# Altium schematic sheet Peripherals.SchDoc
size A4
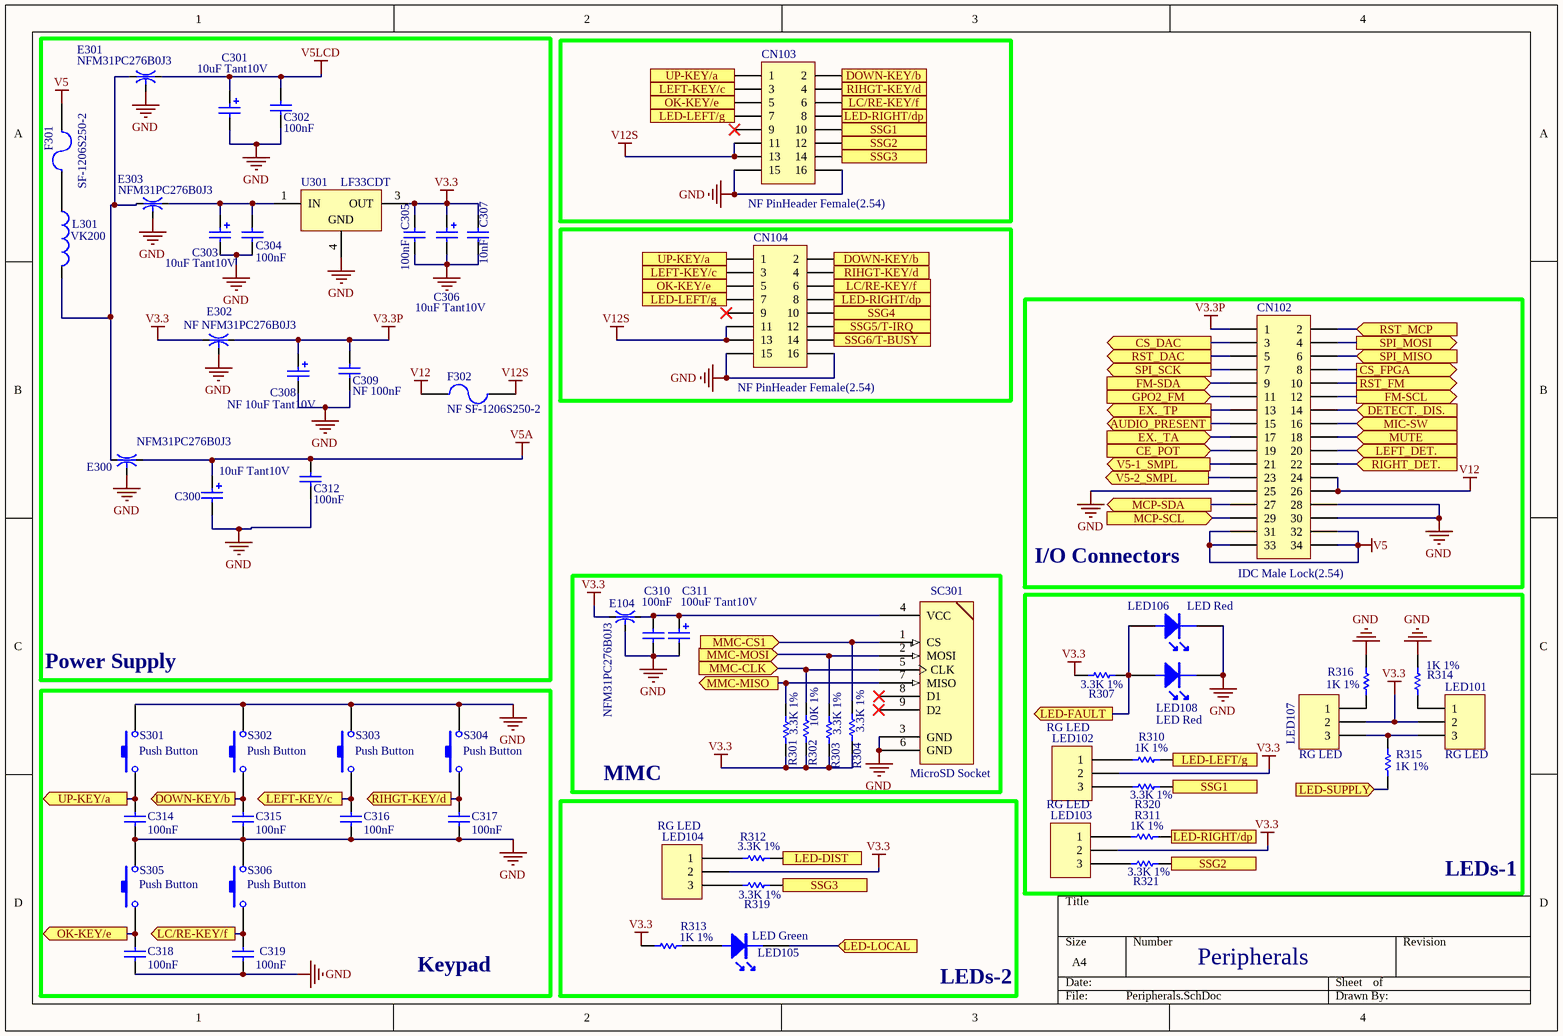
[diagram p0: Peripherals.SchDoc]

## Parts
C300  10uF Tant10V  [A]
C301  10uF Tant10V  [A]
C302  100nF  [1206_FA]
C303  10uF Tant10V  [A]
C304  100nF  [1206_FA]
C305  100nF  [1206_FA]
C306  10uF Tant10V  [A]
C307  10nF  [1206_FA]
C308  NF 10uF Tant10V  [A]
C309  NF 100nF  [1206_FA]
C310  100nF  [1206_FA]
C311  100uF Tant10V  [C]
C312  100nF  [1206_FA]
C314  100nF  [1206_FA]
C315  100nF  [1206_FA]
C316  100nF  [1206_FA]
C317  100nF  [1206_FA]
C318  100nF  [1206_FA]
C319  100nF  [1206_FA]
CN102  IDC Male Lock(2.54)  [IDC_LOCK 2X17]
CN103  NF PinHeader Female(2.54)  [HDR2*8_M]
CN104  NF PinHeader Female(2.54)  [HDR2*8_M]
E104  NFM31PC276B0J3  [EMI1206]
E300  NFM31PC276B0J3  [EMI-1206]
E301  NFM31PC276B0J3  [EMI1206]
E302  NF NFM31PC276B0J3  [EMI1206]
E303  NFM31PC276B0J3  [EMI1206]
F301  SF-1206S250-2  [1206_FA]
F302  NF SF-1206S250-2  [1206_FA]
L301  VK200  [VK200]
LED101  RG LED  [LED3CA]
LED102  RG LED  [LED3CA]
LED103  RG LED  [LED3CA]
LED104  RG LED  [LED3CA]
LED105  LED Green  [LED RADIALl 0.1]
LED106  LED Red  [LED RADIALl 0.1]
LED107  RG LED  [LED3CA]
LED108  LED Red  [LED RADIALl 0.1]
R301  3.3K 1%  [1206_FA]
R302  10K 1%  [1206_FA]
R303  3.3K 1%  [1206_FA]
R304  3.3K 1%  [1206_FA]
R307  3.3K 1%  [1206_FA]
R310  1K 1%  [1206_FA]
R311  1K 1%  [1206_FA]
R312  3.3K 1%  [1206_FA]
R313  1K 1%  [1206_FA]
R314  1K 1%  [1206_FA]
R315  1K 1%  [1206_FA]
R316  1K 1%  [1206_FA]
R319  3.3K 1%  [1206_FA]
R320  3.3K 1%  [1206_FA]
R321  3.3K 1%  [1206_FA]
S301  value Push Button  [Push Bottom  12*12*22]  (hidden comment: Push Button 12x12x22)
S302  value Push Button  [Push Bottom  12*12*22]  (hidden comment: Push Button 12x12x22)
S303  value Push Button  [Push Bottom  12*12*22]  (hidden comment: Push Button 12x12x22)
S304  value Push Button  [Push Bottom  12*12*22]  (hidden comment: Push Button 12x12x22)
S305  value Push Button  [Push Bottom  12*12*22]  (hidden comment: Push Button 12x12x22)
S306  value Push Button  [Push Bottom  12*12*22]  (hidden comment: Push Button 12x12x22)
SC301  MicroSD Socket  [Micro SD Sock.]
U301  LF33CDT  [TO-252]

## Blocks framed on the sheet
Power Supply: C300-C309 C312 E300-E303 F301 F302 L301 U301
I/O Connectors: CN102
MMC: C310 C311 E104 R301-R304 SC301
LEDs-1: LED101-LED103 LED106-LED108 R307 R310 R311 R314-R316 R320 R321

## Ports
AUDIO_PRESENT (out), CE_POT (in), CS_DAC (out), CS_FPGA (out), DETECT._DIS. (in), DOWN-KEY/b (out), EX._TA (in), EX._TP (out), FM-SCL (out), FM-SDA (in), GPO2_FM (in), LC/RE-KEY/f (out), LED-DIST (in), LED-FAULT (out), LED-LEFT/g (out), LED-LOCAL (in), LED-RIGHT/dp (out), LED-SUPPLY (in), LEFT-KEY/c (out), LEFT_DET. (in), MCP-SCL (in), MCP-SDA (out), MIC-SW (in), MMC-CLK (in), MMC-CS1 (in), MMC-MISO (out), MMC-MOSI (in), MUTE (in), OK-KEY/e (out), RIGHT_DET. (in), RIHGT-KEY/d (out), RST_DAC (out), RST_FM (out), RST_MCP (in), SPI_MISO (in), SPI_MOSI (out), SPI_SCK (out), SSG1 (out), SSG2 (out), SSG3 (out), SSG4 (out), SSG5/T-IRQ (out), SSG6/T-BUSY (out), UP-KEY/a (out), V5-1_SMPL (out), V5-2_SMPL (out)

## Nets
GND: C300.2 C301.2 C302.1 C303.2 C304.1 C305.1 C306.2 C307.1 C308.2 C309.1 C310.2 C311.2 C312.1 C314.1 C315.1 C316.1 C317.1 C318.1 C319.1 CN102.25 CN102.28 CN102.30 CN103.15 CN103.16 CN104.15 CN104.16 E104.2 E300.2 E301.2 E302.2 E303.2 LED106.K LED108.K R314.2 R316.2 S301.2 S302.2 S303.2 S304.2 S305.2 S306.2 SC301.3(GND) SC301.6(GND) U301.4(GND)
V3.3: C305.2 C306.1 C307.2 E104.1 E302.1 LED101.2 LED102.2 LED103.2 LED104.2 LED107.2 R301.1 R302.1 R303.1 R304.1 R307.2 R313.2 U301.3(OUT)
V3.3P: C308.1 C309.2 CN102.1 E302.3
V5: CN102.31 CN102.32 CN102.33 CN102.34 F301.2
V5A: C300.1 C312.2 E300.3
V5LCD: C301.1 C302.2 E301.3
V12: CN102.24 CN102.26 F302.1
V12S: CN103.11 CN103.13 CN104.11 CN104.13 F302.2
AUDIO_PRESENT: CN102.15 ; port AUDIO_PRESENT
CE_POT: CN102.19 ; port CE_POT
CS_DAC: CN102.3 ; port CS_DAC
CS_FPGA: CN102.8 ; port CS_FPGA
DETECT._DIS.: CN102.14 ; port DETECT._DIS.
DOWN-KEY/b: C315.2 CN103.2 CN104.2 S302.1 ; port DOWN-KEY/b
EX._TA: CN102.17 ; port EX._TA
EX._TP: CN102.13 ; port EX._TP
FM-SCL: CN102.12 ; port FM-SCL
FM-SDA: CN102.9 ; port FM-SDA
GPO2_FM: CN102.11 ; port GPO2_FM
LC/RE-KEY/f: C319.2 CN103.6 CN104.6 S306.1 ; port LC/RE-KEY/f
LED-DIST: R312.1 ; port LED-DIST
LED-FAULT: LED106.A LED108.A R307.1 ; port LED-FAULT
LED-LEFT/g: CN103.7 CN104.7 R310.1 ; port LED-LEFT/g
LED-LOCAL: LED105.K ; port LED-LOCAL
LED-RIGHT/dp: CN103.8 CN104.8 R311.1 ; port LED-RIGHT/dp
LED-SUPPLY: R315.1 ; port LED-SUPPLY
LEFT-KEY/c: C316.2 CN103.3 CN104.3 S303.1 ; port LEFT-KEY/c
LEFT_DET.: CN102.20 ; port LEFT_DET.
MCP-SCL: CN102.29 ; port MCP-SCL
MCP-SDA: CN102.27 ; port MCP-SDA
MIC-SW: CN102.16 ; port MIC-SW
MMC-CLK: R302.2 SC301.5(CLK) ; port MMC-CLK
MMC-CS1: R304.2 SC301.1(CS) ; port MMC-CS1
MMC-MISO: R301.2 SC301.7(MISO) ; port MMC-MISO
MMC-MOSI: R303.2 SC301.2(MOSI) ; port MMC-MOSI
MUTE: CN102.18 ; port MUTE
OK-KEY/e: C318.2 CN103.5 CN104.5 S305.1 ; port OK-KEY/e
RIGHT_DET.: CN102.22 ; port RIGHT_DET.
RIHGT-KEY/d: C317.2 CN103.4 CN104.4 S304.1 ; port RIHGT-KEY/d
RST_DAC: CN102.5 ; port RST_DAC
RST_FM: CN102.10 ; port RST_FM
RST_MCP: CN102.2 ; port RST_MCP
SPI_MISO: CN102.6 ; port SPI_MISO
SPI_MOSI: CN102.4 ; port SPI_MOSI
SPI_SCK: CN102.7 ; port SPI_SCK
SSG1: CN103.10 R320.1 ; port SSG1
SSG2: CN103.12 R321.1 ; port SSG2
SSG3: CN103.14 R319.1 ; port SSG3
SSG4: CN104.10 ; port SSG4
SSG5/T-IRQ: CN104.12 ; port SSG5/T-IRQ
SSG6/T-BUSY: CN104.14 ; port SSG6/T-BUSY
UP-KEY/a: C314.2 CN103.1 CN104.1 S301.1 ; port UP-KEY/a
V5-1_SMPL: CN102.21 ; port V5-1_SMPL
V5-2_SMPL: CN102.23 ; port V5-2_SMPL
NetC303_1: C303.1 C304.2 E303.3 U301.1(IN)
NetC310_1: C310.1 C311.1 E104.3 SC301.4(VCC)
NetE300_1: E300.1 E301.1 E303.1 L301.2
NetF301_1: F301.1 L301.1
NetLED101_1: LED101.1 R314.1
NetLED101_3: LED101.3 LED107.3 R315.2
NetLED102_1: LED102.1 R310.2
NetLED102_3: LED102.3 R320.2
NetLED103_1: LED103.1 R311.2
NetLED103_3: LED103.3 R321.2
NetLED104_1: LED104.1 R312.2
NetLED104_3: LED104.3 R319.2
NetLED105_A: LED105.A R313.1
NetLED107_1: LED107.1 R316.1

Not connected (* = marked no-connect by the designer): CN103 9*; CN104 9*; SC301 8(D1)* 9(D2)*

## Notes on the sheet
- Keypad
- LEDs-2
- Peripherals

## Library data of the parts
C300 C301 C303 C306 C308 C311 = Cap Pol3: Polarized Capacitor (Surface Mount); Value: 100pF; Published: 8-Jun-2000; LatestRevisionDate: 17-Jul-2002; LatestRevisionNote: Re-released for DXP Platform.; PackageReference: C0805; Publisher: Altium Limited
C302 C304 C305 C307 C309 C310 C312 C314-C319 = Cap Semi: Capacitor (Semiconductor SIM Model); Value: 100pF; Published: 8-Jun-2000; PackageReference: C1206; Publisher: Altium Limited; LatestRevisionDate: 17-Jul-2002; LatestRevisionNote: Re-released for DXP Platform.
CN102 = Header 17X2: Header, 17-Pin, Dual row; LatestRevisionDate: 17-Jul-2002; LatestRevisionNote: Re-released for DXP Platform.; Publisher: Altium Limited
CN103 CN104 = Header 8X2: Header, 8-Pin, Dual row; LatestRevisionDate: 17-Jul-2002; LatestRevisionNote: Re-released for DXP Platform.; Publisher: Altium Limited
E104 E300-E303 = Component_1
F301 F302 = Fuse 2: Fuse; Published: 8-Jun-2000; LatestRevisionDate: 17-Jul-2002; LatestRevisionNote: Re-released for DXP Platform.; PackageReference: PIN-W2/E2.8; Publisher: Altium Limited
L301 = Inductor: Code_IEC: 1005; Published: 8-Jun-2000; LatestRevisionDate: 17-Jul-2002; LatestRevisionNote: Re-released for DXP Platform.; PackageReference: 0402-A; Publisher: Altium Limited; Code_JEITA: 0402
LED101-LED104 LED107 = Header 3H: Header, 3-Pin, Right Angle; LatestRevisionDate: 17-Jul-2002; LatestRevisionNote: Re-released for DXP Platform.; Publisher: Altium Limited
LED105 LED106 LED108 = LED
R301-R304 R307 R312 R319-R321 = Res Semi: Semiconductor Resistor; Value: 1K; Published: 8-Jun-2000; LatestRevisionDate: 17-Jul-2002; LatestRevisionNote: Re-released for DXP Platform.; PackageReference: AXIAL-0.5; Publisher: Altium Limited
R310 R311 R313-R316 = Res Semi: Semiconductor Resistor; Published: 8-Jun-2000; LatestRevisionDate: 17-Jul-2002; LatestRevisionNote: Re-released for DXP Platform.; PackageReference: AXIAL-0.5; Publisher: Altium Limited; Value: 1K
S301-S306 = SW-PB: Switch; Published: 24-Mar-1999; LatestRevisionDate: 17-Jul-2002; LatestRevisionNote: Re-released for DXP Platform.; PackageReference: SPST-2; Publisher: Altium Limited
SC301 = ATMEGA163_DIP40: Atmel Microcontroller - Library created by carel..  <www.mpfreezone.com>
U301 = LF33CDT: 500mA, Very Low Drop (0.45V) Voltage Regulator; Published: 24-Aug-2001; LatestRevisionDate: 06-Jun-2005; LatestRevisionNote: PCB pads lengthened.; DatasheetVersion: Feb-2004; PackageVersion: Jun-2004; PackageReference: TO-252; Publisher: Altium Limited; PackageDescription: D-PAK/TO-252-AA; 3 Leads (1 Cropped); Body 10.1 (inc. leads) x 6.6 mm (LxW max); ComponentLink1Description: Manufacturer Link; ComponentLink1URL: http://www.st.com/; ComponentLink2Description: Datasheet; ComponentLink2URL: http://www.st.com/stonline/books/pdf/docs/2574.pdf